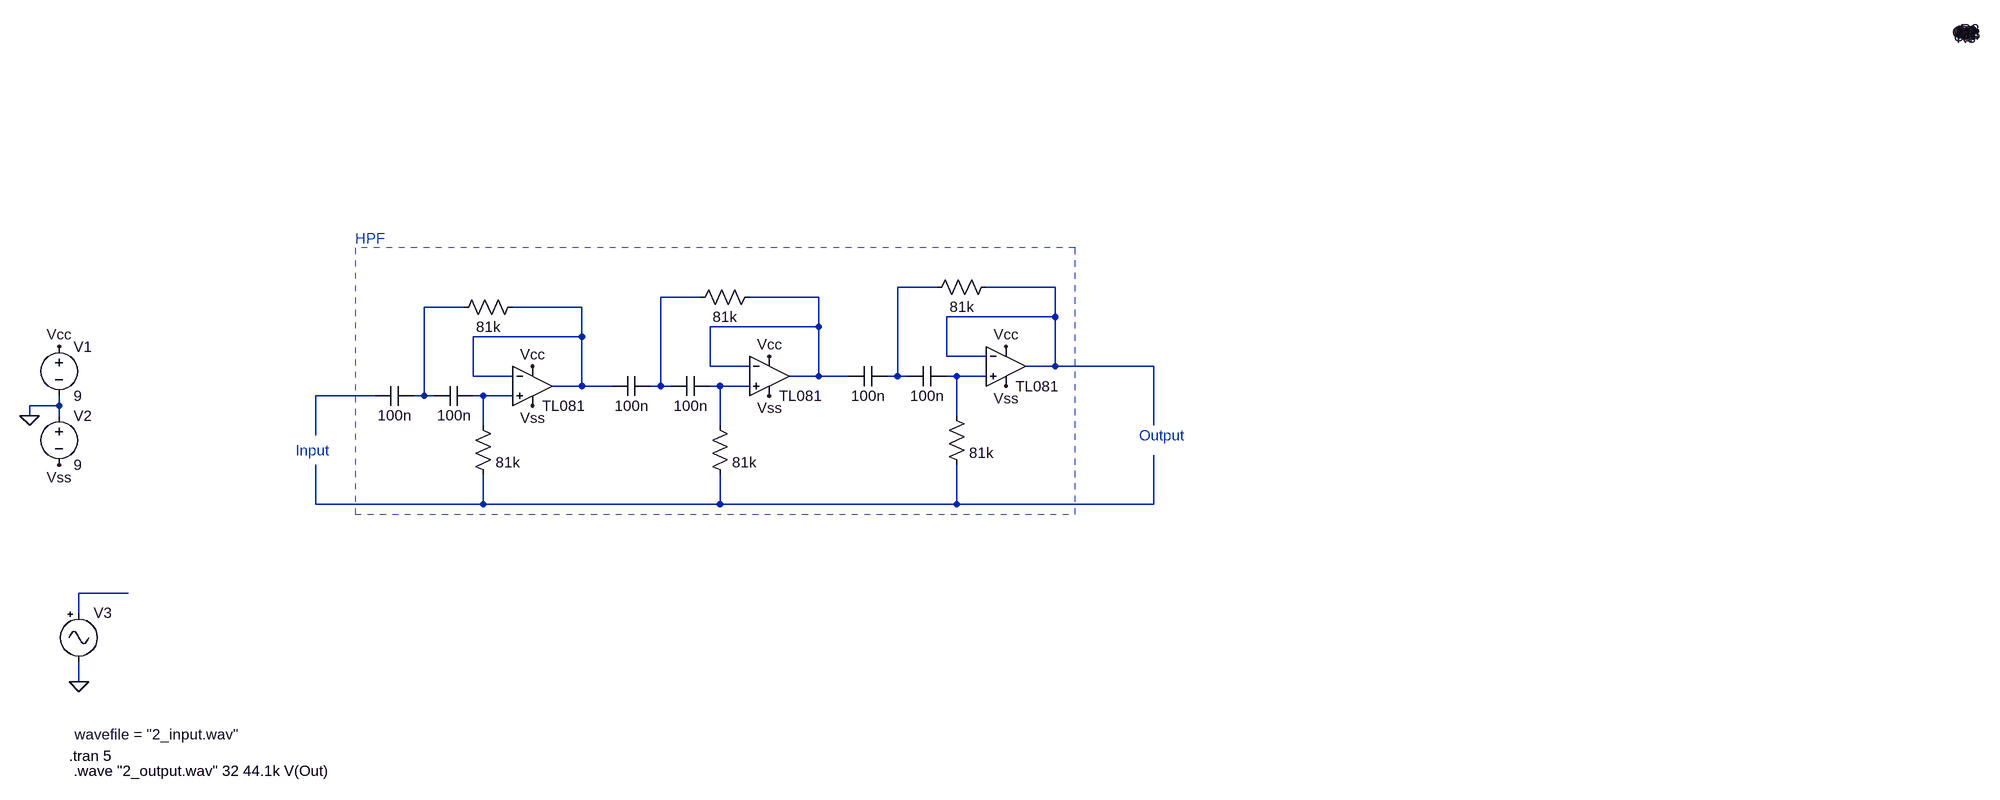
[diagram p0: schematic 2_HPF.asc]
2_HPF.asc, the LTspice schematic file:
Version 4
SHEET 1 2528 752
WIRE 832 -48 768 -48
WIRE 1024 -48 912 -48
WIRE 448 -32 384 -32
WIRE 640 -32 528 -32
WIRE 64 -16 0 -16
WIRE 256 -16 144 -16
WIRE 1024 0 1024 -48
WIRE 1024 0 848 0
WIRE 640 16 640 -32
WIRE 640 16 464 16
WIRE 256 32 256 -16
WIRE 256 32 80 32
WIRE 848 64 848 0
WIRE 912 64 848 64
WIRE 464 80 464 16
WIRE 528 80 464 80
WIRE 1024 80 1024 0
WIRE 1024 80 976 80
WIRE 1184 80 1024 80
WIRE 80 96 80 32
WIRE 144 96 80 96
WIRE 640 96 640 16
WIRE 640 96 592 96
WIRE 688 96 640 96
WIRE 768 96 768 -48
WIRE 768 96 752 96
WIRE 784 96 768 96
WIRE 864 96 848 96
WIRE 912 96 864 96
WIRE 256 112 256 32
WIRE 256 112 208 112
WIRE 304 112 256 112
WIRE 384 112 384 -32
WIRE 384 112 368 112
WIRE 400 112 384 112
WIRE 480 112 464 112
WIRE 528 112 480 112
WIRE -80 128 -176 128
WIRE 0 128 0 -16
WIRE 0 128 -16 128
WIRE 16 128 0 128
WIRE 96 128 80 128
WIRE 144 128 96 128
WIRE -592 144 -592 128
WIRE -592 144 -640 144
WIRE -640 160 -640 144
WIRE -592 160 -592 144
WIRE 864 160 864 96
WIRE 96 176 96 128
WIRE 480 176 480 112
WIRE 1184 176 1184 80
WIRE -176 192 -176 128
WIRE -176 304 -176 240
WIRE 96 304 96 256
WIRE 96 304 -176 304
WIRE 480 304 480 256
WIRE 480 304 96 304
WIRE 864 304 864 240
WIRE 864 304 480 304
WIRE 1184 304 1184 224
WIRE 1184 304 864 304
WIRE -480 448 -560 448
WIRE -560 480 -560 448
WIRE -560 592 -560 560
FLAG -640 160 0
FLAG -592 48 Vcc
FLAG -592 240 Vss
FLAG -560 592 0
FLAG 176 80 Vcc
FLAG 176 144 Vss
FLAG 560 64 Vcc
FLAG 560 128 Vss
FLAG 944 48 Vcc
FLAG 944 112 Vss
SYMBOL voltage -592 32 R0
WINDOW 123 0 0 Left 0
WINDOW 39 0 0 Left 0
SYMATTR InstName V1
SYMATTR Value 9
SYMBOL voltage -592 144 R0
WINDOW 123 0 0 Left 0
WINDOW 39 0 0 Left 0
SYMATTR InstName V2
SYMATTR Value 9
SYMBOL Misc\\signal -560 464 R0
WINDOW 3 -7 213 Left 2
SYMATTR Value wavefile = "2_input.wav"
SYMATTR InstName V3
SYMBOL res 80 160 R0
WINDOW 0 2406 -618 Left 2
SYMATTR InstName R1
SYMATTR Value 81k
SYMBOL cap 80 112 R90
WINDOW 0 -558 -2414 VBottom 2
WINDOW 3 32 32 VTop 2
SYMATTR InstName C1
SYMATTR Value 100n
SYMBOL cap -16 112 R90
WINDOW 0 -556 -2522 VBottom 2
WINDOW 3 32 32 VTop 2
SYMATTR InstName C2
SYMATTR Value 100n
SYMBOL res 160 -32 R90
WINDOW 0 -419 -2347 VBottom 2
WINDOW 3 32 56 VTop 2
SYMATTR InstName R2
SYMATTR Value 81k
SYMBOL AutoGenerated\\TL081 176 48 R0
WINDOW 0 2305 -503 Left 2
SYMATTR InstName U1
SYMBOL res 464 160 R0
WINDOW 0 2022 -613 Left 2
SYMATTR InstName R3
SYMATTR Value 81k
SYMBOL cap 464 96 R90
WINDOW 0 -540 -2045 VBottom 2
WINDOW 3 32 32 VTop 2
SYMATTR InstName C3
SYMATTR Value 100n
SYMBOL cap 368 96 R90
WINDOW 0 -538 -2140 VBottom 2
WINDOW 3 32 32 VTop 2
SYMATTR InstName C4
SYMATTR Value 100n
SYMBOL res 544 -48 R90
WINDOW 0 -399 -1955 VBottom 2
WINDOW 3 32 56 VTop 2
SYMATTR InstName R4
SYMATTR Value 81k
SYMBOL AutoGenerated\\TL081 560 32 R0
WINDOW 0 1929 -495 Left 2
SYMATTR InstName U2
SYMBOL res 848 144 R0
WINDOW 0 1638 -602 Left 2
SYMATTR InstName R5
SYMATTR Value 81k
SYMBOL cap 848 80 R90
WINDOW 0 -528 -1649 VBottom 2
WINDOW 3 32 32 VTop 2
SYMATTR InstName C5
SYMATTR Value 100n
SYMBOL cap 752 80 R90
WINDOW 0 -526 -1748 VBottom 2
WINDOW 3 32 32 VTop 2
SYMATTR InstName C6
SYMATTR Value 100n
SYMBOL res 928 -64 R90
WINDOW 0 -385 -1574 VBottom 2
WINDOW 3 32 56 VTop 2
SYMATTR InstName R6
SYMATTR Value 81k
SYMBOL AutoGenerated\\TL081 944 16 R0
WINDOW 0 1542 -478 Left 2
SYMATTR InstName U3
TEXT -576 712 Left 2 !.tran 5
TEXT -568 736 Left 2 !.wave "2_output.wav" 32 44.1k V(Out)
TEXT -112 -128 Left 2 ;HPF
TEXT -208 216 Left 2 ;Input
TEXT 1160 192 Left 2 ;Output
RECTANGLE Normal -112 320 1056 -112 2

The netlist it stands for:
* 2_HPF.asc
V1 Vcc 0 9
V2 0 Vss 9
V3 N012 0 wavefile = "2_input.wav"
R1 N010 N011 81k
C1 N010 N005 100n
C2 N005 N009 100n
R2 N006 N005 81k
* U1: TL081 (symbol AutoGenerated\TL081 not available, pins judged from their places): In+=N010 In-=N006 V+=Vcc V-=Vss OUT=N006
R3 N008 N011 81k
C3 N008 N003 100n
C4 N003 N006 100n
R4 N004 N003 81k
* U2: TL081 (symbol AutoGenerated\TL081 not available, pins judged from their places): In+=N008 In-=N004 V+=Vcc V-=Vss OUT=N004
R5 N007 N011 81k
C5 N007 N001 100n
C6 N001 N004 100n
R6 N002 N001 81k
* U3: TL081 (symbol AutoGenerated\TL081 not available, pins judged from their places): In+=N007 In-=N002 V+=Vcc V-=Vss OUT=N002
.tran 5
.wave "2_output.wav" 32 44.1k V(Out)
* HPF
* Input
* Output
.backanno
.end